# EAGLE design Mega8 (EAGLE 7.4.0)
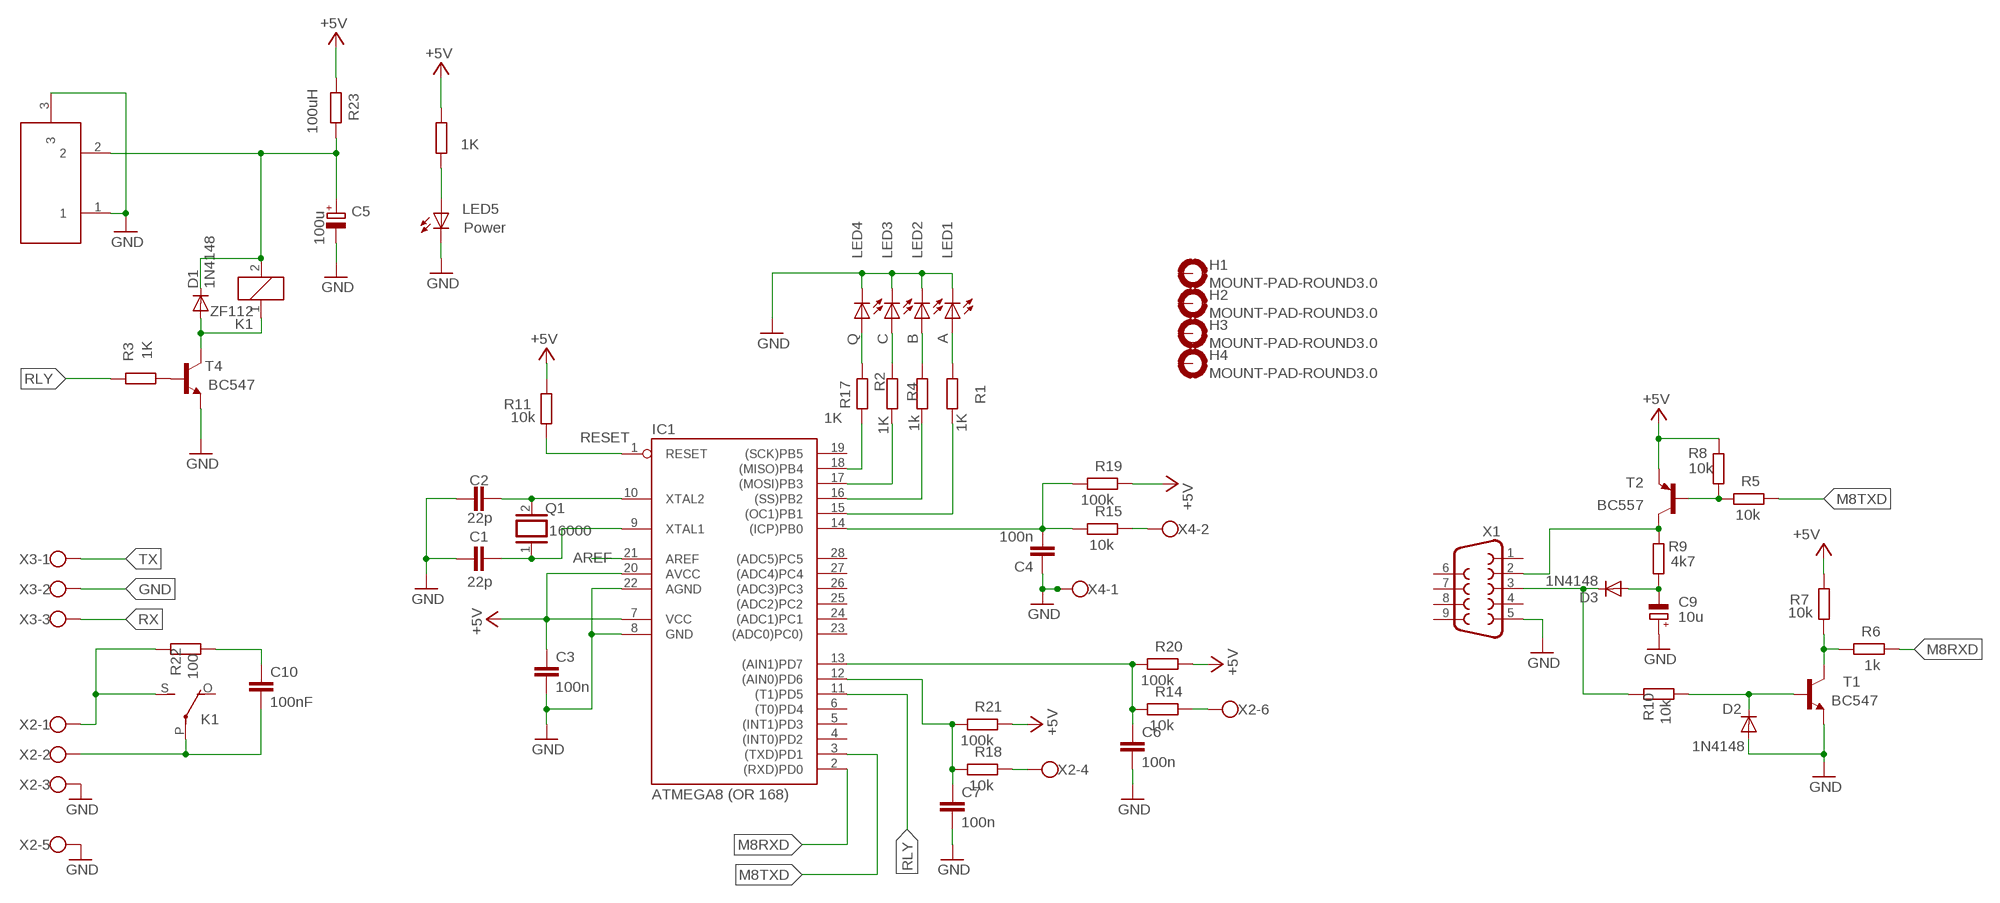
[diagram p0: schematic, sheet 1]

## Parts
C1  22p  C-EU050-025X075  [C050-025X075]
C2  22p  C-EU050-025X075  [C050-025X075]
C3  100n  C-EU050-025X075  [C050-025X075]
C4  100n  C-EU050-025X075  [C050-025X075]
C5  100u  CPOL-EUE3.5-8  [E3,5-8]
C6  100n  C-EU050-025X075  [C050-025X075]
C7  100n  C-EU050-025X075  [C050-025X075]
C9  10u  CPOL-EUE5-6  [E5-6]
C10  100nF  C-EU102-043X133  [C102-043X133]
D1  1N4148  [DO35-10]
D2  1N4148  [DO35-10]
D3  1N4148  [DO35-10]
DC1  DC21MMX  [DC-21MM]
H1  MOUNT-PAD-ROUND3.0  [3,0-PAD]
H2  MOUNT-PAD-ROUND3.0  [3,0-PAD]
H3  MOUNT-PAD-ROUND3.0  [3,0-PAD]
H4  MOUNT-PAD-ROUND3.0  [3,0-PAD]
IC1  ATMEGA8 (OR 168)  AT90S4433P  [DIL28-3]
K1  ZF112  [ZF112]
LED1  A  LED3MM  [LED3MM]
LED2  B  LED3MM  [LED3MM]
LED3  C  LED3MM  [LED3MM]
LED4  Q  LED3MM  [LED3MM]
LED5  Power  LED3MM  [LED3MM]
Q1  16000  XTAL  [Q]
R1  1K  R-EU_0207/10  [0207/10]
R2  1K  R-EU_0207/10  [0207/10]
R3  1K  R-EU_0207/10  [0207/10]
R4  1k  R-EU_0207/10  [0207/10]
R5  10k  R-EU_0207/10  [0207/10]
R6  1k  R-EU_0207/10  [0207/10]
R7  10k  R-EU_0207/10  [0207/10]
R8  10k  R-EU_0207/10  [0207/10]
R9  4k7  R-EU_0207/10  [0207/10]
R10  10k  R-EU_0207/10  [0207/10]
R11  10k  R-EU_0207/10  [0207/10]
R14  10k  R-EU_0207/10  [0207/10]
R15  10k  R-EU_0207/10  [0207/10]
R16  1K  R-EU_0207/10  [0207/10]
R17  1K  R-EU_0207/10  [0207/10]
R18  10k  R-EU_0207/10  [0207/10]
R19  100k  R-EU_0207/10  [0207/10]
R20  100k  R-EU_0207/10  [0207/10]
R21  100k  R-EU_0207/10  [0207/10]
R22  100  R-EU_0207/10  [0207/10]
R23  100uH  R-EU_0207/10  [0207/10]
T1  BC547  [TO92]
T2  BC557  BC557B-PNP-TO92-EBC  [TO92-EBC]
T4  BC547  [TO92]
X1  F09H  [F09H]
X2  W237-6  [W237-6]
X3  W237-103  [W237-103]
X4  W237-102  [W237-102]

## Nets
+5V [power]: C3.1 IC1.7(VCC) IC1.20(AVCC) R7.2 R8.1 R11.2 R16.2 R19.1 R20.1 R21.1 R23.2 T2.E
AREF: IC1.21(AREF)
GND: C1.1 C2.1 C3.2 C4.1 C5.- C6.2 C7.2 C9.+ D2.A DC1.1 DC1.3 IC1.8(GND) IC1.22(AGND) LED1.K(C) LED2.K(C) LED3.K(C) LED4.K(C) LED5.K(C) T1.1(E) T4.1(E) X1.5 X2.3 X2.5 X3.2 X4.1
M8RXD: IC1.2((RXD)PD0) R6.1
M8TXD: IC1.3((TXD)PD1) R5.1
N$1: R3.1 T4.2(B)
N$2: C9.- D3.A R9.1
N$3: LED2.A R4.1
N$4: D1.A K1.1 T4.3(C)
N$5: R18.1 X2.4
N$6: C1.2 IC1.9(XTAL1) Q1.1
N$7: C2.2 IC1.10(XTAL2) Q1.2
N$8: K1.S(2:S) R22.2 X2.1
N$9: C10.2 K1.P(2:P) X2.2
N$13: C4.2 IC1.14((ICP)PB0) R15.2 R19.2
N$14: C6.1 IC1.13((AIN1)PD7) R14.2 R20.2
N$15: R14.1 X2.6
N$16: IC1.15((OC1)PB1) R1.2
N$17: IC1.16((SS)PB2) R4.2
N$18: IC1.17((MOSI)PB3) R2.2
N$19: LED5.A R16.1
N$20: C7.1 IC1.12((AIN0)PD6) R18.2 R21.2
N$21: LED4.A R17.1
N$22: IC1.18((MISO)PB4) R17.2
N$23: R15.1 X4.2
N$26: R6.2 R7.1 T1.3(C)
N$27: R5.2 R8.2 T2.B
N$28: C10.1 R22.1
N$29: D2.C R10.1 T1.2(B)
N$30 [power]: C5.+ D1.C DC1.2 K1.2 R23.1
N$32: LED3.A R2.1
N$33: LED1.A R1.1
RESET: IC1.1(RESET) R11.1
RLY: IC1.11((T1)PD5) R3.2
RX: D3.C R10.2 X1.3 X3.3
TX: R9.2 T2.C X1.2 X3.1
Unconnected: H1.B3,0(MOUNT) H2.B3,0(MOUNT) H3.B3,0(MOUNT) H4.B3,0(MOUNT) IC1.4((INT0)PD2) IC1.5((INT1)PD3) IC1.6((T0)PD4) IC1.19((SCK)PB5) IC1.23((ADC0)PC0)) IC1.24((ADC1)PC1) IC1.25((ADC2)PC2) IC1.26((ADC3)PC3) IC1.27((ADC4)PC4) IC1.28((ADC5)PC5) K1.O(2:O) X1.1 X1.4 X1.6 X1.7 X1.8 X1.9

## Library data of the parts
C1-C4 C6 C7 C10 = rcl:C-EU: CAPACITOR, European symbol
C5 C9 = rcl:CPOL-EU: POLARIZED CAPACITOR, European symbol
D1-D3 = diode:1N4148: DIODE high speed (Philips)
DC1 = powersupply:DC21MM
H1-H4 = holes:MOUNT-PAD-ROUND: MOUNTING PAD, round
IC1 = atmel:AT90S4433: MICROCONTROLLER 4 Kbytes FLASH 128 bytes SRAM 256 bytes EEPROM UART 6-channel 10 bit ADC
K1 = relay:ZF112: RELAY 1 x switch; OC_FARNELL: unknown; OC_NEWARK: unknown
LED1-LED5 = led:LED: LED OSRAM: - CHIPLED LG R971, LG N971, LY N971, LG Q971, LY Q971, LO R971, LY R971 LH N974, LH R974 LS Q976, LO Q976, LY Q976 LO Q996 - Hyper CHIPLED LW Q18S LB Q993, LB Q99A, LB R99A - SideLED LS A670, LO A670, LY A670, LG A670, LP A670 LB A673, LV A673, LT A673, LW A673 LH A674 LY A675 LS A676, LA A676, LO A676, LY A676, LW A676 LS A679, LY A679, LG A679 - Hyper Micro SIDELED® LS Y876, LA Y876, LO Y876, LY Y876 LT Y87S - SmartLED LW L88C, LW L88S LB L89C, LB L89S, LG L890 LS L89K, LO L89K, LY L89K LS L896, LA L896, LO L896, LY L896 - TOPLED LS T670, LO T670, LY T670, LG T670, LP T670 LSG T670, LSP T670, LSY T670, LOP T670, LYG T670 LG T671, LOG T671, LSG T671 LB T673, LV T673, LT T673, LW T673 LH T674 LS T676, LA T676, LO T676, LY T676, LB T676, LH T676, LSB T676, LW T676 LB T67C, LV T67C, LT T67C, LS T67K, LO T67K, LY T67K, LW E67C LS E67B, LA E67B, LO E67B, LY E67B, LB E67C, LV E67C, LT E67C LW T67C LS T679, LY T679, LG T679 LS T770, LO T770, LY T770, LG T770, LP T770 LB T773, LV T773, LT T773, LW T773 LH T774 LS E675, LA E675, LY E675, LS T675 LS T776, LA T776, LO T776, LY T776, LB T776 LHGB T686 LT T68C, LB T68C - Hyper Mini TOPLED® LB M676 - Mini TOPLED Santana® LG M470 LS M47K, LO M47K, LY M47K Source: http://www.osram.convergy.de/
Q1 = special:XTAL: CRYSTAL
R1-R11 R14-R23 = rcl:R-EU_: RESISTOR, European symbol
T1 T4 = transistor:BC547: NPN TRANSISTOR
T2 = transistor:*-PNP-: PNP Transistror
X1 = con-subd:F09: SUB-D
X2 = con-wago-500:W237-6: WAGO SCREW CLAMP; OC_FARNELL: unknown; OC_NEWARK: unknown
X3 = con-wago-500:W237-103: WAGO SCREW CLAMP; MPN: 237-103; OC_FARNELL: unknown; OC_NEWARK: 18M7116
X4 = con-wago-500:W237-102: WAGO SCREW CLAMP; MPN: 237-102; OC_FARNELL: unknown; OC_NEWARK: 70K9898

## Net classes
1 power: width 0.61 mm

## Board
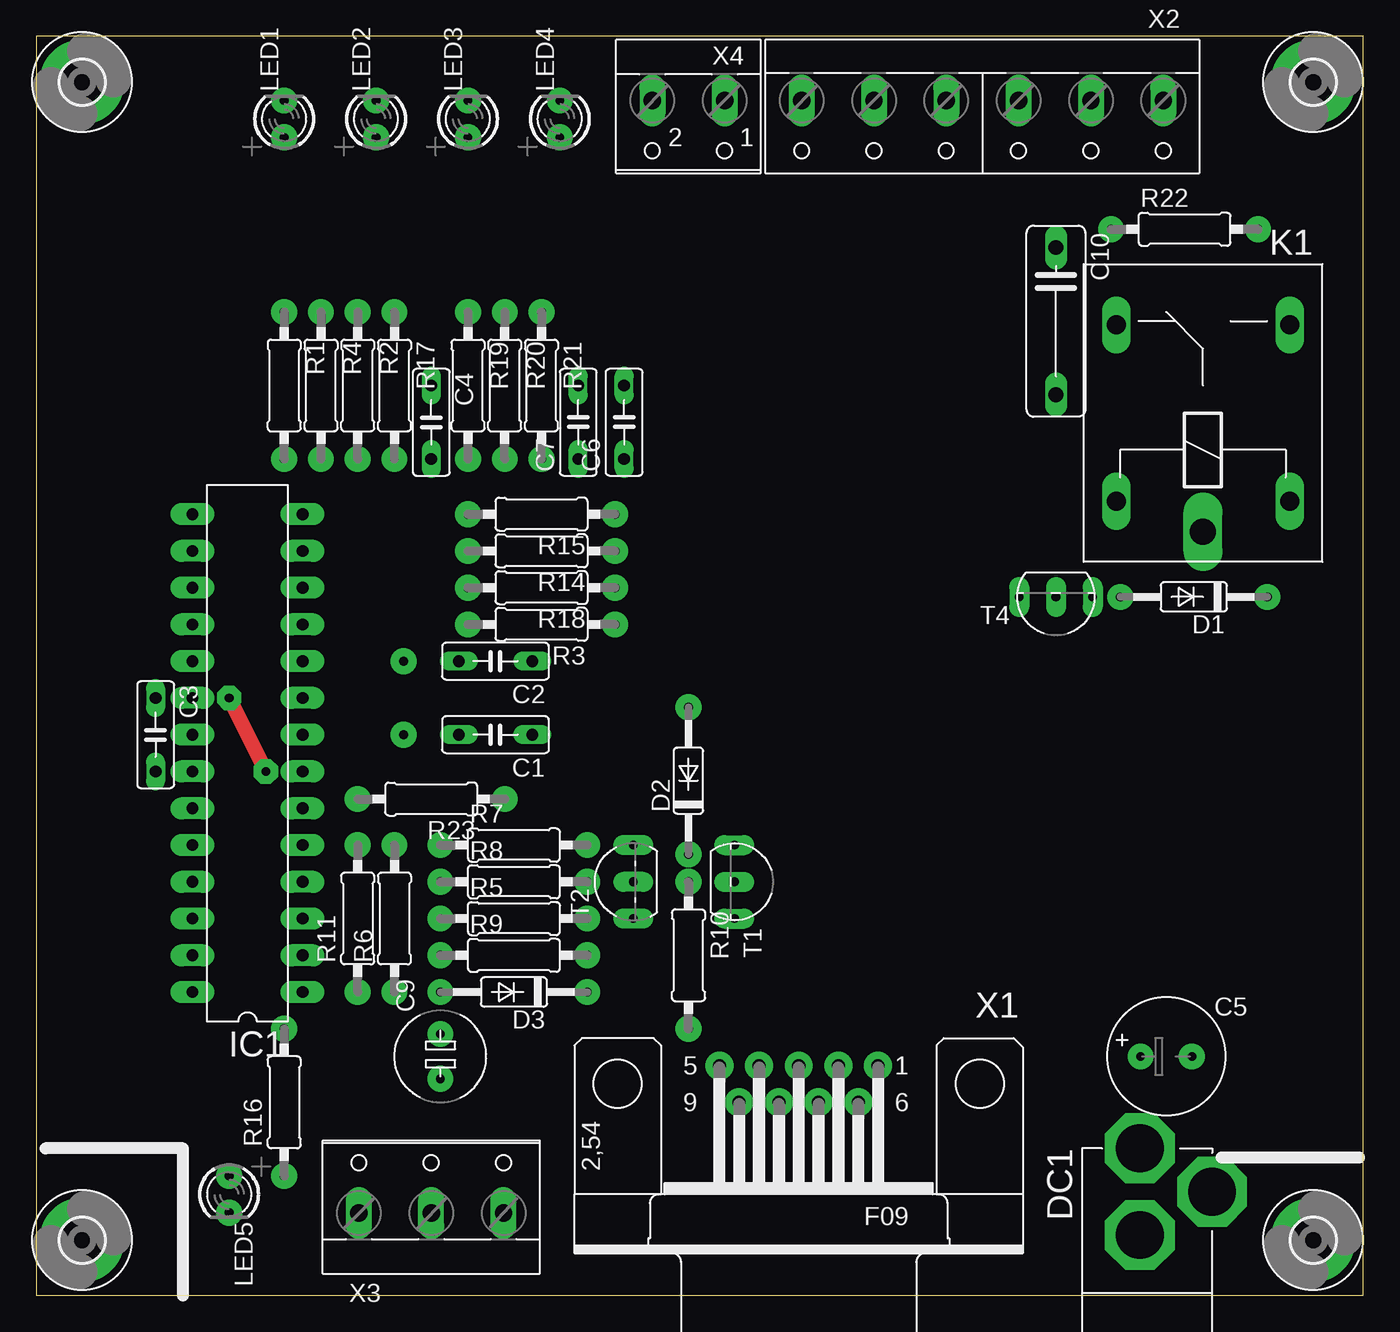
[diagram p1: board, top side]
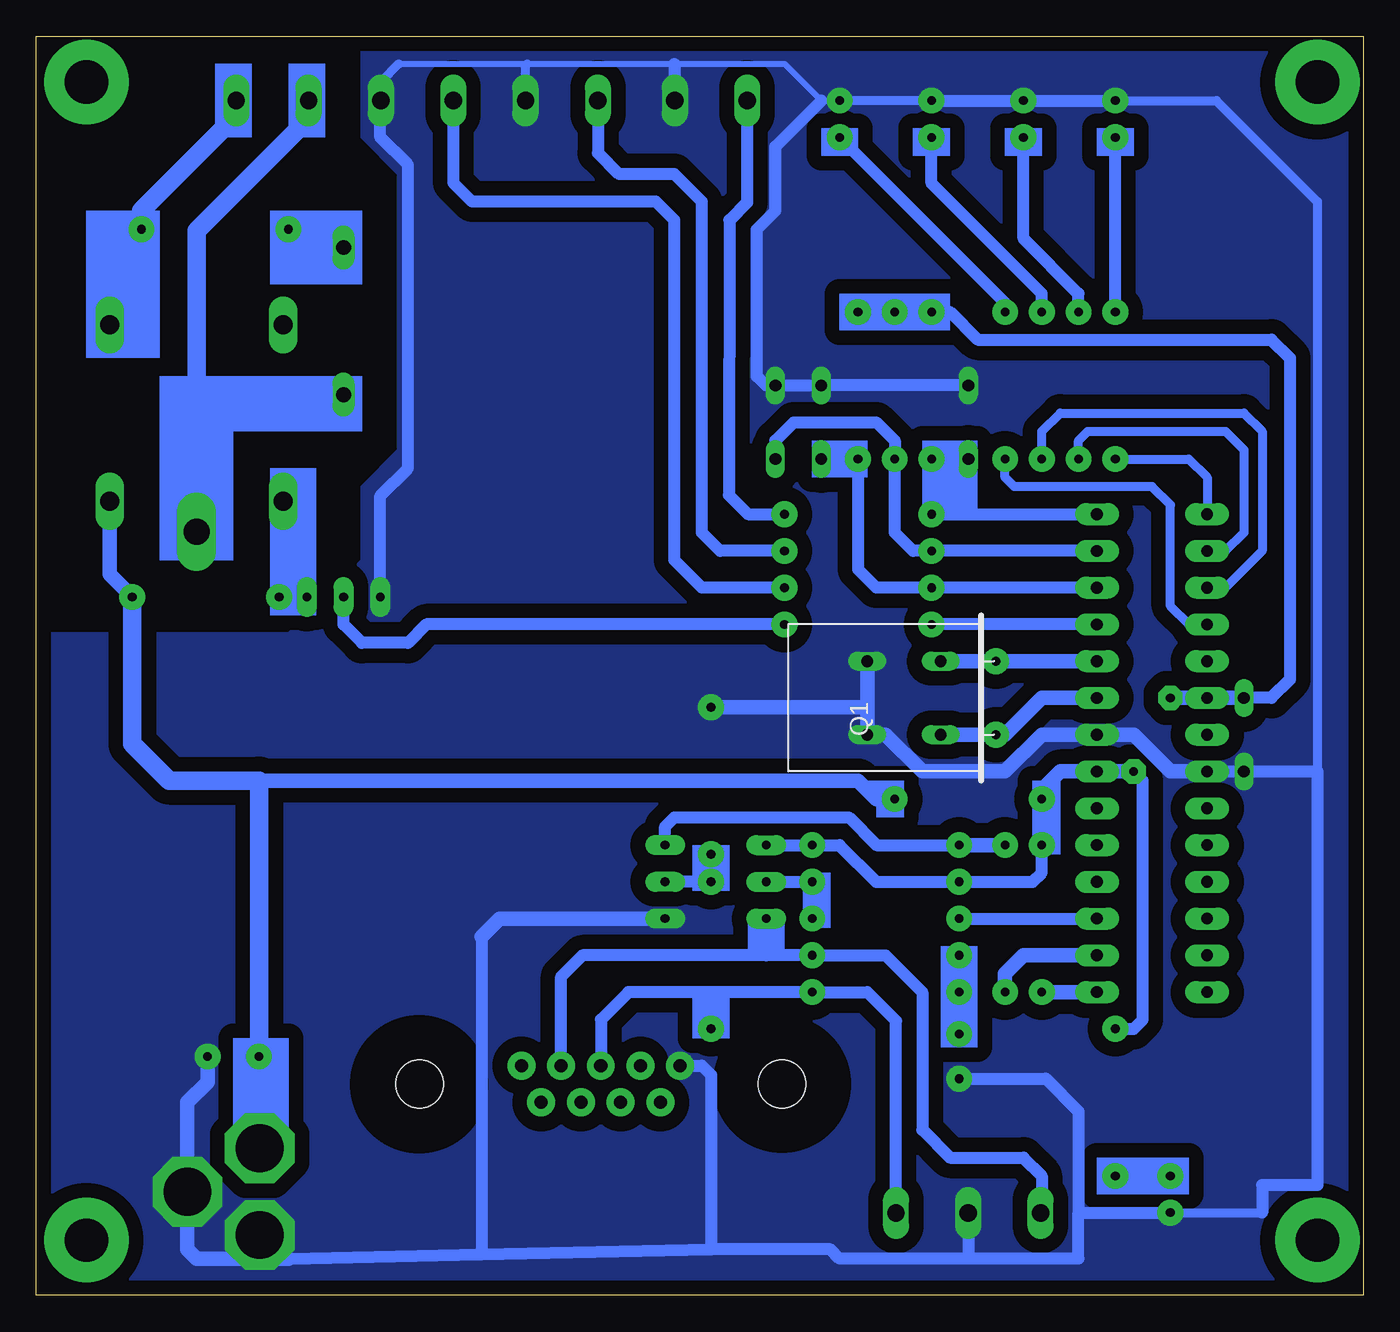
[diagram p2: board, bottom side, seen from below]

Size 91.73 x 87 mm. Coordinates in mm from the lower left corner, seen from the top.
Outline: 0,0 91.73,0 91.73,87 0,87 0,0
Copper layers (1*16): Top 0.035mm / dielectric 1.5mm / Bottom 0.035mm
Design rules "default": minimum track width 10mil, minimum drill 24mil, track to track 8mil, track to pad 8mil, pad to pad 8mil, via to via 8mil, smd to smd 8mil, copper to edge 40mil, drill to drill 8mil, minimum pad ring 10mil, minimum via ring 8mil, stop-mask expansion 4mil, vias tented up to drill 0mil, thermal gap 10mil

### Footprints (pad centres in the part's own frame; a part is rotated, then mirrored left to right if it is on the bottom)
C050-025X075 = drill 0.813 long: 1 -2.54,0; 2 2.54,0
E3,5-8 = drill 0.6 pad 1.778: + -1.778,0; - 1.778,0
E5-6 = drill 0.6 pad 1.778: + -1.54,0; - 1.54,0
C102-043X133 = drill 1.016 long: 1 -5.08,0; 2 5.08,0
DO35-10 = drill 0.6 pad 1.778: A 5.08,0; C -5.08,0
DC-21MM = drill 3.302 pad 4.826 octagon: 1 -5.08,-3.353; 2 -0.076,-6.35; 3 -0.076,-0.356
3,0-PAD = drill 3 pad 5.842: B3,0 0,0
DIL28-3 = drill 0.813 pad 1.524 long: 1 -16.51,-3.81; 2 -13.97,-3.81; 3 -11.43,-3.81; 4 -8.89,-3.81; 5 -6.35,-3.81; 6 -3.81,-3.81; 7 -1.27,-3.81; 8 1.27,-3.81; 9 3.81,-3.81; 10 6.35,-3.81; 11 8.89,-3.81; 12 11.43,-3.81; 13 13.97,-3.81; 14 16.51,-3.81; 15 16.51,3.81; 16 13.97,3.81; 17 11.43,3.81; 18 8.89,3.81; 19 6.35,3.81; 20 3.81,3.81; 21 1.27,3.81; 22 -1.27,3.81; 23 -3.81,3.81; 24 -6.35,3.81; 25 -8.89,3.81; 26 -11.43,3.81; 27 -13.97,3.81; 28 -16.51,3.81
ZF112 = drill 1.321 long: 1 -6.096,5.994; 2 -6.096,-5.994; O 6.096,5.994; S 6.096,-5.994 | drill 1.803 long: P -8.204,0
LED3MM = drill 0.6 pad 1.778: A -1.27,0; K 1.27,0
Q = drill 0.6 pad 1.778: 1 -2.54,-7.62; 2 2.54,-7.62
0207/10 = drill 0.6 pad 1.778: 1 -5.08,0; 2 5.08,0
TO92 = drill 0.6 pad 1.372 long: 1 2.54,0; 2 0,0; 3 -2.54,0
TO92-EBC = drill 0.6 pad 1.372 long: B 0,-1.27; C -2.54,-1.27; E 2.54,-1.27
F09H = drill 0.9 pad 1.93: 1 -5.486,-1.27; 2 -2.743,-1.27; 3 0,-1.27; 4 2.743,-1.27; 5 5.486,-1.27; 6 -4.115,1.27; 7 -1.372,1.27; 8 1.372,1.27; 9 4.115,1.27 | hole 3.302: -12.522,0; 12.522,0
W237-6 = drill 1.194 long: 1 -12.5,-1.27; 2 -7.5,-1.27; 3 -2.5,-1.27; 4 2.5,-1.27; 5 7.5,-1.27; 6 12.5,-1.27
W237-103 = drill 1.194 long: 1 -5,-1.29; 2 0,-1.29; 3 5,-1.29
W237-102 = drill 1.194 long: 1 -2.5,-1.27; 2 2.5,-1.27

### Placement (x,y rotation side)
C1  31.75,38.73 180 top
C2  31.75,43.81 180 top
C3  8.26,38.73 270 top
C4  27.3,60.33 270 top
C5  78.1,16.51 0 top
C6  40.64,60.33 90 top
C7  37.47,60.33 90 top
C9  27.94,16.51 90 top
C10  70.48,67.31 270 top
D1  80.01,48.26 180 top
D2  45.09,35.56 90 top
D3  33.02,20.95 180 top
DC1  76.2,3.81 180 top
H1  88.27,3.81 0 top
H2  88.27,83.82 0 top
H3  3.17,83.82 0 top
H4  3.17,3.81 0 top
IC1  14.61,37.47 90 top
K1  80.64,60.96 90 top
LED1  17.14,81.28 90 top
LED2  23.49,81.28 90 top
LED3  29.84,81.28 90 top
LED4  36.2,81.28 90 top
LED5  13.34,6.99 270 top
Q1  33.02,41.27 90 bottom
R1  17.14,62.87 270 top
R2  22.22,62.87 270 top
R3  34.93,46.35 180 top
R4  19.68,62.87 270 top
R5  33.02,26.04 0 top
R6  24.76,26.04 90 top
R7  33.02,31.11 0 top
R8  33.02,28.57 0 top
R9  33.02,23.5 0 top
R10  45.09,23.5 270 top
R11  22.22,26.04 90 top
R14  34.93,51.44 180 top
R15  34.93,53.98 180 top
R16  17.14,13.34 90 top
R17  24.76,62.87 270 top
R18  34.93,48.9 180 top
R19  29.84,62.87 270 top
R20  32.39,62.87 270 top
R21  34.93,62.87 270 top
R22  79.38,73.66 0 top
R23  27.3,34.29 180 top
T1  48.26,28.57 270 top
T2  40.01,28.57 90 top
T4  70.48,48.26 180 top
X1  52.71,14.61 180 top
X2  65.41,81.28 180 top
X3  27.3,6.99 0 top
X4  45.09,81.28 180 top

### Tracks (layer width: path | path; a pad name or v marks a point on that pad's centre or on a via)
+5V  (via drill 0.6 pad 1.68)
  Top 1.016: v13.34,41.27 v15.88,36.2
  Bottom 0.813: R11.2 22.22,29.21 22.86,28.57 R8.1 33.66,28.57 36.2,31.11 R7.2 T2.E | R16.2 15.88,18.41 15.24,19.05 15.24,35.56 v15.88,36.2 | R21.1 R20.1 R19.1 28.57,67.94 26.67,66.04 6.35,66.04 5.08,64.77 5.08,42.55 6.35,41.27 C3.1
  Bottom 1.016: v13.34,41.27 IC1.20 C3.1 | v15.88,36.2 IC1.7 20.95,36.2 22.22,34.92 R23.2 R11.2
GND
  Bottom 0.406: 66.67,85.09 57.79,85.09 47.62,85.09 40.01,85.09 37.47,82.55 LED4.K
  Bottom 0.61: LED5.K 6.99,5.71 | LED3.K LED4.K | X2.5 57.91,84.97 57.79,85.09 | X2.3 67.91,83.86 66.67,85.09 | LED1.K 10.16,82.55 3.17,75.56 3.17,36.2
  Bottom 0.813: LED3.K LED2.K LED1.K | X1.5 45.72,15.88 45.09,15.24 45.09,3.17 | C9.+ 21.95,14.97 19.68,12.7 19.68,5.71 | 19.68,5.71 LED5.K | 74.3,2.54 60.97,2.83 | 60.97,2.83 45.09,3.17 | 27.3,2.54 19.68,2.54 19.68,5.71 | 27.3,2.54 36.2,2.54 36.83,3.17 45.09,3.17 | 60.96,24.77 60.96,2.84 60.97,2.83 | IC1.22 C3.2 3.17,36.2 3.17,7.62 6.99,7.62 6.99,5.71 | T4.1 67.94,55.24 66.04,57.15 66.04,78.11 67.94,80.01 67.94,82.51 X2.3 | X4.1 47.59,85.05 47.62,85.09 | 37.47,82.55 40.64,79.38 40.64,74.93 41.91,73.66 41.91,63.5 41.27,62.87 C6.2 C7.2 C4.1 | X3.2 27.3,2.54
  Bottom 1.016: IC1.22 13.34,36.2 15.88,38.73 IC1.8 22.22,38.73 24.76,36.2 30.48,36.2 33.02,38.73 C1.1 34.29,40.64 | C2.1 34.29,40.64 | D2.A 34.29,40.64 | T1.1 59.69,26.04 60.96,24.77 | C5.- 79.88,14.73 81.28,13.34 DC1.1 81.28,3.17 80.64,2.54 76.2,2.54 | 76.2,2.54 74.3,2.54 | DC1.3 76.28,2.62 76.2,2.54
  pour Bottom (isolate 1.016, no thermals): -0.64,87.63 -0.64,-0.64 92.07,-0.64 92.07,45.72 74.3,45.72 69.21,50.8 69.21,55.88 66.67,58.42 66.67,77.47 69.21,80.01 69.21,87.63
M8RXD
  Bottom 1.016: IC1.2 23.49,23.5 24.76,22.23 R6.1
M8TXD
  Bottom 0.813: R5.1 IC1.3
N$1
  Bottom 0.813: R3.1 64.77,46.35 66.04,45.09 69.21,45.09 70.48,46.35 T4.2
N$2
  Bottom 0.813: R9.1 D3.A C9.-
N$3
  Bottom 0.813: R4.1 19.68,69.22 23.49,73.03 LED2.A
N$4
  Bottom 1.016: T4.3 D1.A 74.65,48.54 K1.1
N$5
  Bottom 0.813: R18.1 45.72,48.9 47.62,50.8 47.62,74.3 48.9,75.56 61.59,75.56 62.91,76.88 X2.4
N$6
  Bottom 1.016: IC1.9 22.22,41.27 24.76,38.73 Q1.1 C1.2
N$7
  Bottom 1.016: IC1.10 Q1.2 C2.2
N$8
  Bottom 1.27: X2.1 78.1,82.35 78.1,81.28 84.45,74.93 R22.2 84.45,69.24 K1.S
N$9
  Bottom 1.27: X2.2 72.91,81.28 80.64,73.54 80.64,62.23 | 80.64,62.23 K1.P | C10.2 80.64,62.23
N$13
  Bottom 0.813: IC1.14 R15.2 R19.2 C4.2
N$14
  Bottom 0.813: IC1.13 R14.2 31.11,51.44 32.39,52.7 R20.2 32.39,59.05 33.66,60.33 39.37,60.33 40.64,59.05 C6.1
N$15
  Bottom 0.813: R14.1 44.45,51.44 45.72,52.7 45.72,75.56 47.62,77.47 51.44,77.47 52.91,78.94 X2.6
N$16
  Bottom 0.61: R1.2 12.06,57.78 10.79,56.52 IC1.15
N$17
  Bottom 0.61: R4.2 19.68,59.05 19.05,59.69 9.53,59.69 8.26,58.42 8.26,52.7 9.53,51.44 IC1.16
N$18
  Bottom 0.61: R2.2 22.22,59.69 20.95,60.96 8.26,60.96 6.99,59.69 6.99,51.44 9.53,48.9 IC1.17
N$19
  Bottom 1.016: R16.1 LED5.A
N$20
  Bottom 0.813: IC1.12 R18.2 33.66,48.9 34.93,50.16 R21.2 C7.1
N$21
  Bottom 0.813: R17.1 24.76,68.58 LED4.A
N$22
  Bottom 0.61: IC1.18 12.06,46.35 13.34,47.62 13.34,54.61 14.61,55.88 24.13,55.88 24.76,56.52 R17.2
N$23
  Bottom 0.813: R15.1 42.55,53.98 43.86,55.28 43.82,74.3 42.59,75.53 X4.2
N$26
  Bottom 0.813: T1.3 48.26,32.38 47.62,33.02 35.56,33.02 33.66,31.11 R7.1
  Bottom 1.016: R6.2 R7.1
N$27
  Bottom 0.813: T2.B R8.2
  Bottom 1.016: R8.2 R5.2
N$28
  Bottom 1.27: C10.1 71.75,72.39 73.02,73.66 R22.1
N$29
  Bottom 0.813: T1.2 R10.1 D2.C
N$30
  Bottom 1.016: R23.1 33.66,34.29 34.93,35.56 76.33,35.56 | K1.2 86.64,49.81 D1.C | DC1.2 76.28,16.46 C5.+
  Bottom 1.27: D1.C 85.09,38.1 82.55,35.56 76.33,35.56 C5.+
N$32
  Bottom 0.813: R2.1 22.22,69.22 29.84,76.83 LED3.A
N$33
  Bottom 0.813: R1.1 LED1.A
RESET
  Bottom 1.016: IC1.1 R11.1
RLY
  Bottom 0.813: IC1.11 R3.2
RX
  Bottom 0.813: 45.09,20.95 D3.C 34.29,20.95 32.3,18.97 X3.3 | 45.09,20.95 50.8,20.95 52.71,19.05 X1.3 | R10.2 45.09,20.95
TX
  Bottom 0.813: X3.1 22.22,5.78 22.22,8.26 23.49,9.53 28.57,9.53 30.48,11.43 30.48,20.95 33.02,23.5 R9.2 41.27,23.5 | 41.27,23.5 53.98,23.5 55.45,22.02 X1.2 | T2.C 41.27,23.5
(copper drawn outside any net)
  shapes: Bottom area x24